# Altium schematic sheet clk.SchDoc
size A2
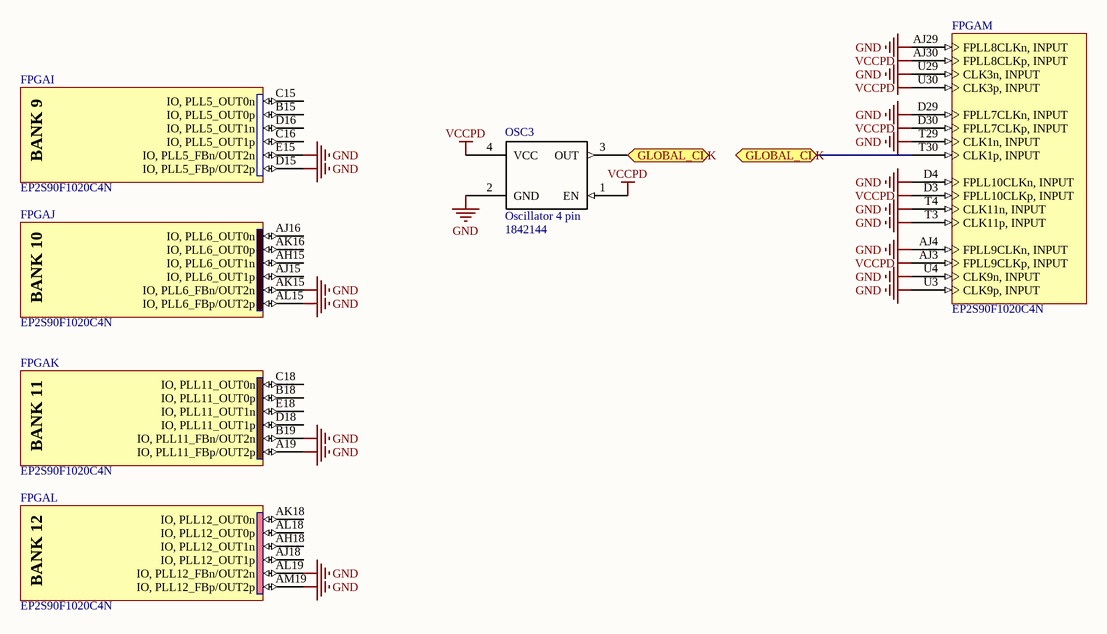
[diagram p0: clk.SchDoc]

## Parts
FPGA  EP2S90F1020C4N  [FBGA1020]  (parts I,J,K,L,M of 18)
OSC3  Oscillator 4 pin  Supplier Part Number 1: 1842144  [SMD Crystal 7x5 mm]

## Ports
GLOBAL_CLK

## Nets
GND: FPGA.A19(IO,_PLL11_FBp/OUT2p) FPGA.AJ4(FPLL9CLKn,_INPUT) FPGA.AJ29(FPLL8CLKn,_INPUT) FPGA.AK15(IO,_PLL6_FBn/OUT2n) FPGA.AL15(IO,_PLL6_FBp/OUT2p) FPGA.AL19(IO,_PLL12_FBn/OUT2n) FPGA.AM19(IO,_PLL12_FBp/OUT2p) FPGA.B19(IO,_PLL11_FBn/OUT2n) FPGA.D4(FPLL10CLKn,_INPUT) FPGA.D15(IO,_PLL5_FBp/OUT2p) FPGA.D29(FPLL7CLKn,_INPUT) FPGA.E15(IO,_PLL5_FBn/OUT2n) FPGA.T3(CLK11p,_INPUT) FPGA.T4(CLK11n,_INPUT) FPGA.T29(CLK1n,_INPUT) FPGA.U3(CLK9p,_INPUT) FPGA.U4(CLK9n,_INPUT) FPGA.U29(CLK3n,_INPUT) OSC3.2(GND)
VCCPD: FPGA.AJ3(FPLL9CLKp,_INPUT) FPGA.AJ30(FPLL8CLKp,_INPUT) FPGA.D3(FPLL10CLKp,_INPUT) FPGA.D30(FPLL7CLKp,_INPUT) FPGA.U30(CLK3p,_INPUT) OSC3.1(EN) OSC3.4(VCC)
GLOBAL_CLK: FPGA.T30(CLK1p,_INPUT) OSC3.3(OUT) ; port GLOBAL_CLK

Not connected (* = marked no-connect by the designer): FPGA AH15(IO,_PLL6_OUT1n) AH18(IO,_PLL12_OUT1n) AJ15(IO,_PLL6_OUT1p) AJ16(IO,_PLL6_OUT0n) AJ18(IO,_PLL12_OUT1p) AK16(IO,_PLL6_OUT0p) AK18(IO,_PLL12_OUT0n) AL18(IO,_PLL12_OUT0p) B15(IO,_PLL5_OUT0p) B18(IO,_PLL11_OUT0p) C15(IO,_PLL5_OUT0n) C16(IO,_PLL5_OUT1p) C18(IO,_PLL11_OUT0n) D16(IO,_PLL5_OUT1n) D18(IO,_PLL11_OUT1p) E18(IO,_PLL11_OUT1n)

## Notes on the sheet
- (in symbol EP2S90F1020C4N, part I) BANK 9
- (in symbol EP2S90F1020C4N, part J) BANK 10
- (in symbol EP2S90F1020C4N, part K) BANK 11
- (in symbol EP2S90F1020C4N, part L) BANK 12

## Library data of the parts
FPGA = EP2S90F1020C4N: Stratix II 1.2V FPGA, 758 I/Os, 1020-Pin FineLine BGA, Speed Grade 4, Commercial Grade, Pb-Free; Note: DQS signal pins in banks 3, 4, 7 & 8 named according to DQ bus modes. "/" separates each mode. ie. Mode x4, x8/x9, x16/x18 and x32/x36.; Published: 8-Jul-2005; LatestRevisionDate: 13-Apr-2006; LatestRevisionNote: IPC-7351 Footprint Added.; DatasheetVersion: ver4.3, Jan-2008; PackageVersion: ver15.1, May-2008; PackageReference: FBGA1020; Publisher: Altium Limited; PackageDescription: 1020-Ball FineLine Ball Grid Array (FBGA1020) - Flip Chip; Code_JEDEC: MS-034-AAP-1; ComponentLink1Description: Manufacturer Link; ComponentLink1URL: http://www.altera.com/products/devices/stratix2/st2-index.jsp; ComponentLink2Description: Handbook; ComponentLink2URL: http://www.altera.com/literature/hb/stx2/stratix2_handbook.pdf; ComponentLink3Description: Packaging Specification; ComponentLink3URL: http://www.altera.com/literature/ds/dspkg.pdf
OSC3 = Oscillator 4 pin: Supplier 1: Farnell